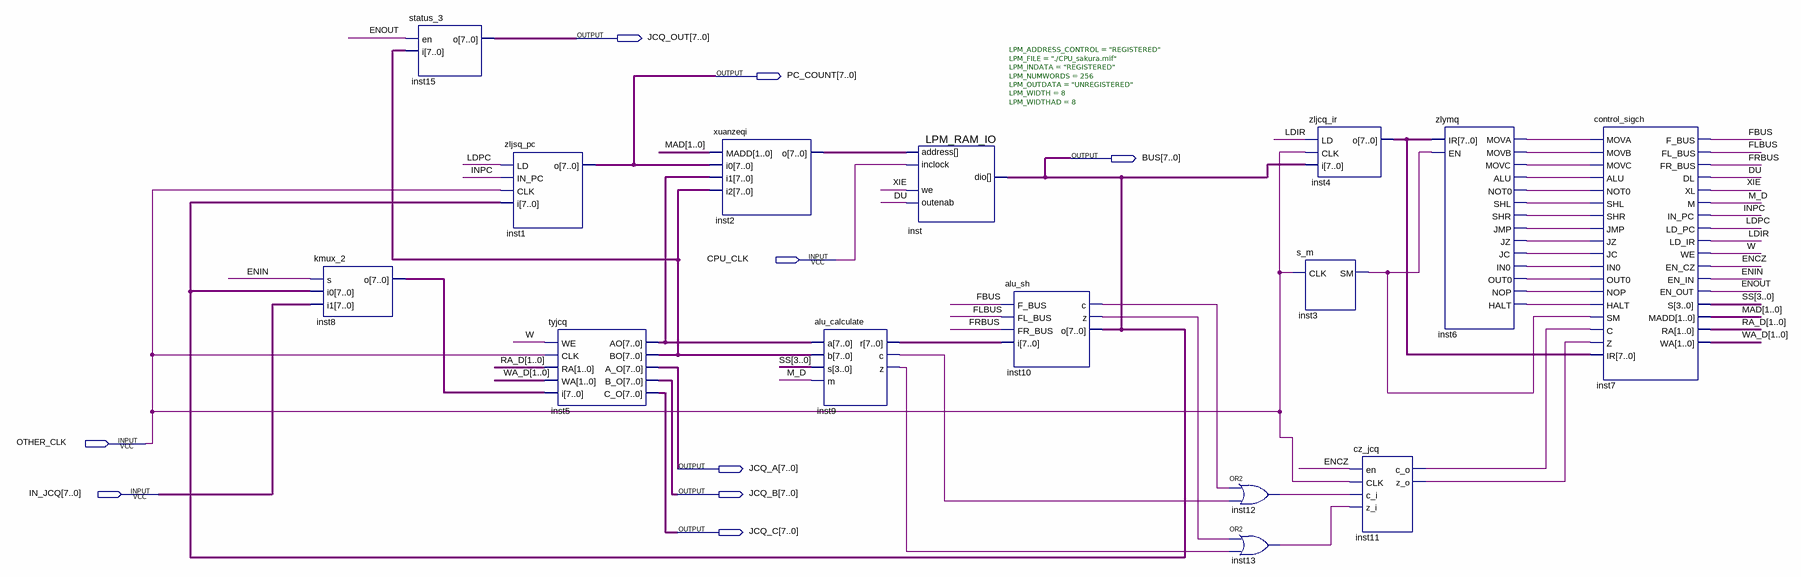
[diagram p0: schematic sheet]
// Quartus schematic CPU_sakura.bdf as structural Verilog: 15 symbols, 9 pins
module CPU_sakura (
  input  CPU_CLK,
  input  OTHER_CLK,
  input  [7:0] IN_JCQ,
  output [7:0] JCQ_OUT,
  output [7:0] PC_COUNT,
  output [7:0] BUS,
  output [7:0] JCQ_A,
  output [7:0] JCQ_B,
  output [7:0] JCQ_C
);

  wire DU, ENCZ, ENIN, ENOUT, FBUS, FLBUS, FRBUS, INPC, inst3_sm, inst6_alu, inst6_halt, inst6_in0, inst6_jc,
       inst6_jmp, inst6_jz, inst6_mova, inst6_movb, inst6_movc, inst6_nop, inst6_not0, inst6_out0, inst6_shl,
       inst6_shr, inst9_c, inst9_z, inst10_c, inst10_z, inst11_c_o, inst11_z_o, inst12_out, inst13_out, LDIR,
       LDPC, M_D, W, XIE;
  wire [1:0] MAD, RA_D, WA_D;
  wire [3:0] SS;
  wire [7:0] inst2_o, inst4_o, inst5_ao, inst5_bo, inst8_o, inst9_r;

  kmux_2 inst8 (.s(ENIN), .i0(BUS), .i1(IN_JCQ), .o(inst8_o));
  status_3 inst15 (.en(ENOUT), .i(inst5_bo), .o(JCQ_OUT));
  zljsq_pc inst1 (.LD(LDPC), .IN_PC(INPC), .CLK(OTHER_CLK), .i(BUS), .o(PC_COUNT));
  tyjcq inst5 (
    .WE(W), .CLK(OTHER_CLK), .RA(RA_D), .WA(WA_D), .i(inst8_o), .AO(inst5_ao), .BO(inst5_bo), .A_O(JCQ_A),
    .B_O(JCQ_B), .C_O(JCQ_C));
  xuanzeqi inst2 (.MADD(MAD), .i0(PC_COUNT), .i1(inst5_ao), .i2(inst5_bo), .o(inst2_o));
  alu_calculate inst9 (.a(inst5_ao), .b(inst5_bo), .s(SS), .m(M_D), .r(inst9_r), .c(inst9_c), .z(inst9_z));
  LPM_RAM_IO #(.LPM_ADDRESS_CONTROL("REGISTERED"), .LPM_FILE("./CPU_sakura.mif"), .LPM_INDATA("REGISTERED"), .LPM_NUMWORDS(256), .LPM_OUTDATA("UNREGISTERED"), .LPM_WIDTH(8), .LPM_WIDTHAD(8)) inst (
    .address(inst2_o), .inclock(CPU_CLK), .we(XIE), .outenab(DU), .dio(BUS));
  alu_sh inst10 (.F_BUS(FBUS), .FL_BUS(FLBUS), .FR_BUS(FRBUS), .i(inst9_r), .c(inst10_c), .z(inst10_z), .o(BUS));
  or inst12 (inst12_out, inst10_c, inst9_c);
  or inst13 (inst13_out, inst10_z, inst9_z);
  zljcq_ir inst4 (.LD(LDIR), .CLK(OTHER_CLK), .i(BUS), .o(inst4_o));
  s_m inst3 (.CLK(OTHER_CLK), .SM(inst3_sm));
  cz_jcq inst11 (.en(ENCZ), .CLK(OTHER_CLK), .c_i(inst12_out), .z_i(inst13_out), .c_o(inst11_c_o), .z_o(inst11_z_o));
  zlymq inst6 (
    .IR(inst4_o), .EN(inst3_sm), .MOVA(inst6_mova), .MOVB(inst6_movb), .MOVC(inst6_movc), .ALU(inst6_alu),
    .NOT0(inst6_not0), .SHL(inst6_shl), .SHR(inst6_shr), .JMP(inst6_jmp), .JZ(inst6_jz), .JC(inst6_jc),
    .IN0(inst6_in0), .OUT0(inst6_out0), .NOP(inst6_nop), .HALT(inst6_halt));
  control_sigch inst7 (
    .MOVA(inst6_mova), .MOVB(inst6_movb), .MOVC(inst6_movc), .ALU(inst6_alu), .NOT0(inst6_not0),
    .SHL(inst6_shl), .SHR(inst6_shr), .JMP(inst6_jmp), .JZ(inst6_jz), .JC(inst6_jc), .IN0(inst6_in0),
    .OUT0(inst6_out0), .NOP(inst6_nop), .HALT(inst6_halt), .SM(inst3_sm), .C(inst11_c_o), .Z(inst11_z_o),
    .IR(inst4_o), .F_BUS(FBUS), .FL_BUS(FLBUS), .FR_BUS(FRBUS), .DL(DU), .XL(XIE), .M(M_D), .IN_PC(INPC),
    .LD_PC(LDPC), .LD_IR(LDIR), .WE(W), .EN_CZ(ENCZ), .EN_IN(ENIN), .EN_OUT(ENOUT), .S(SS), .MADD(MAD),
    .RA(RA_D), .WA(WA_D));
endmodule
